# EAGLE design lightsensor (EAGLE 7.5.0)
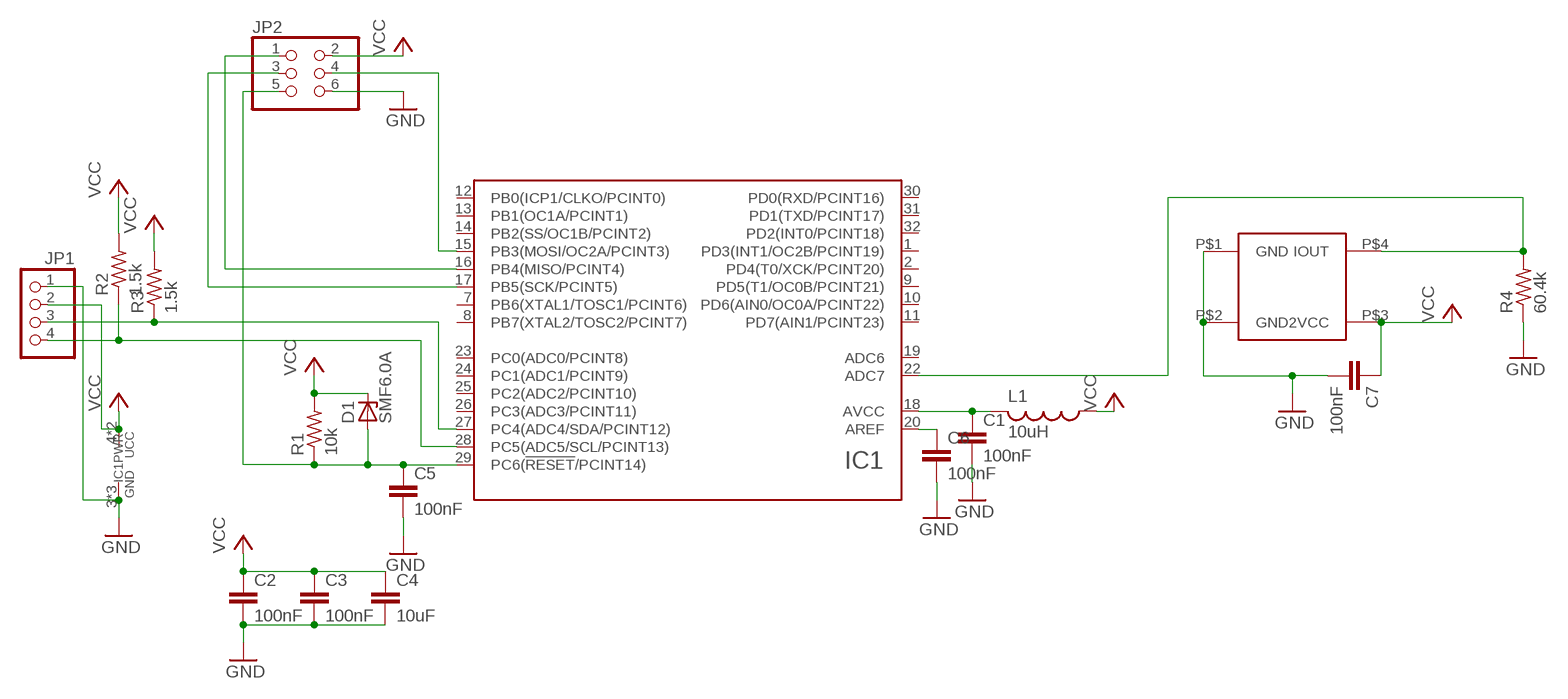
[diagram p0: schematic, sheet 1]

## Parts
C1  100nF  C-EUC0402  [C0402]
C2  100nF  C-EUC0402  [C0402]
C3  100nF  C-EUC0402  [C0402]
C4  10uF  C-EUC0603  [C0603]
C5  100nF  C-EUC0402  [C0402]
C6  100nF  C-EUC0402  [C0402]
C7  100nF  C-EUC0402  [C0402]
D1  SMF6.0A  [SOD123F]
IC1  ATMEGA48/88/168/328-AU  [TQFP32-08]
JP1  PINHD-1X4  [1X04]
JP2  PINHD-2X3  [2X03]
L1  10uH  L-USL2012C  [L2012C]
R1  10k  R-US_R0402  [R0402]
R2  1.5k  R-US_R0402  [R0402]
R3  1.5k  R-US_R0402  [R0402]
R4  60.4k  R-US_R0603  [R0603]
U$1  SFH5711  [SFH5711]

## Nets
GND: C1.2 C2.2 C3.2 C4.2 C5.2 C6.2 C7.2 IC1.3(GND) IC1.5(GND) IC1.21(GND) JP1.1 JP2.6 R4.1 U$1.P$1(GND) U$1.P$2(GND2)
N$1: C1.1 IC1.18(AVCC) L1.2
N$2: IC1.16(PB4(MISO/PCINT4)) JP2.1
N$3: IC1.17(PB5(SCK/PCINT5)) JP2.3
N$4: IC1.15(PB3(MOSI/OC2A/PCINT3)) JP2.4
N$5: C5.1 D1.A IC1.29(PC6(!RESET!/PCINT14)) JP2.5 R1.1
N$6: C6.1 IC1.20(AREF)
N$7: IC1.27(PC4(ADC4/SDA/PCINT12)) JP1.3 R3.1
N$8: IC1.22(ADC7) R4.2 U$1.P$4(IOUT)
N$9: IC1.28(PC5(ADC5/SCL/PCINT13)) JP1.4 R2.1
VCC: C2.1 C3.1 C4.1 C7.1 D1.C IC1.4(UCC) IC1.6(UCC) JP1.2 JP2.2 L1.1 R1.2 R2.2 R3.2 U$1.P$3(VCC)
Unconnected: IC1.1(PD3(INT1/OC2B/PCINT19)) IC1.2(PD4(T0/XCK/PCINT20)) IC1.7(PB6(XTAL1/TOSC1/PCINT6)) IC1.8(PB7(XTAL2/TOSC2/PCINT7)) IC1.9(PD5(T1/OC0B/PCINT21)) IC1.10(PD6(AIN0/OC0A/PCINT22)) IC1.11(PD7(AIN1/PCINT23)) IC1.12(PB0(ICP1/CLKO/PCINT0)) IC1.13(PB1(OC1A/PCINT1)) IC1.14(PB2(SS/OC1B/PCINT2)) IC1.19(ADC6) IC1.23(PC0(ADC0/PCINT8)) IC1.24(PC1(ADC1/PCINT9)) IC1.25(PC2(ADC2/PCINT10)) IC1.26(PC3(ADC3/PCINT11)) IC1.30(PD0(RXD/PCINT16)) IC1.31(PD1(TXD/PCINT17)) IC1.32(PD2(INT0/PCINT18))

## Library data of the parts
C1-C7 = resistor:C-EU: CAPACITOR, European symbol
D1 = smf_10:SMF*A: SMF Series TVS Diodes Source: http://www.littelfuse.com/~/media/electronics/datasheets/tvs_diodes/littelfuse_tvs_diode_smf_datasheet.pdf.pdf; MF: Littelfuse; MPN: SMF6.0A; OC_FARNELL: unknown; OC_NEWARK: unknown
IC1 = atmel_tiny24-44-84tiny48-88mega48-88-168-328:ATMEGA48/88/168/328
JP1 = pinhead:PINHD-1X4: PIN HEADER
JP2 = pinhead:PINHD-2X3: PIN HEADER
L1 = resistor:L-US: INDUCTOR, American symbol
R1-R4 = resistor:R-US_: RESISTOR, American symbol
U$1 = osram:SFH5711

## Board
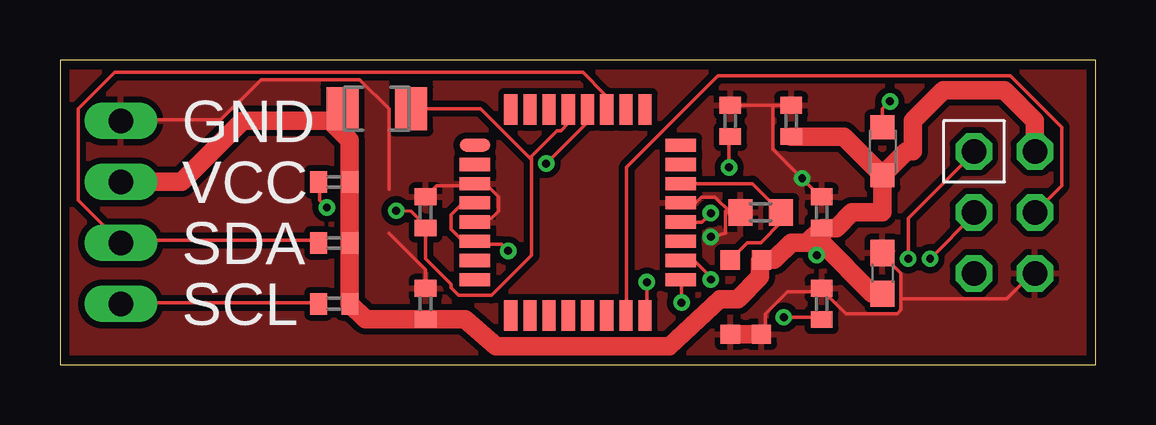
[diagram p1: board, top side]
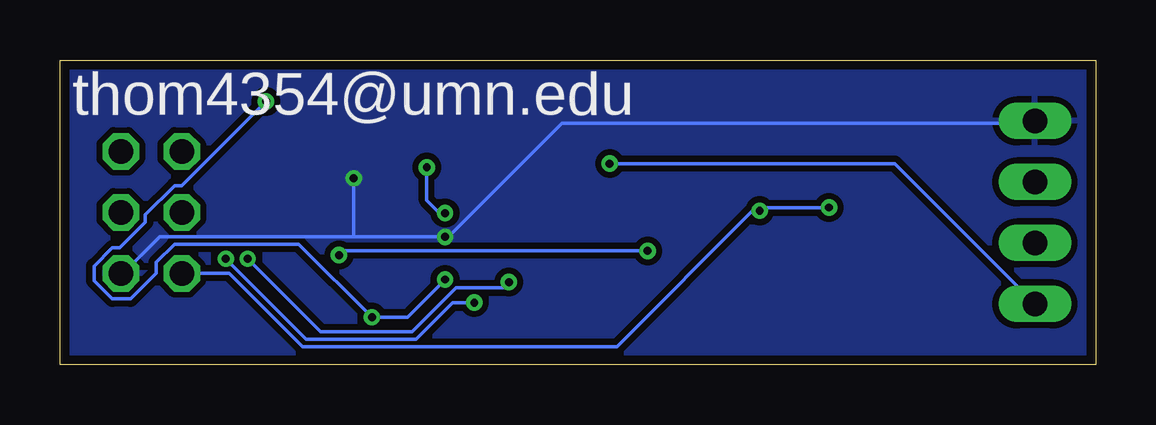
[diagram p2: board, bottom side, seen from below]

Size 43.18 x 12.7 mm. Coordinates in mm from the lower left corner, seen from the top.
Outline: 0,0 43.18,0 43.18,12.7 0,12.7 0,0
Copper layers (1*16): Top 0.0356mm / dielectric 1.5011mm / Bottom 0.0356mm
Design rules "oshpark-2layer": minimum track width 6mil, minimum drill 13mil, track to track 6mil, track to pad 6mil, pad to pad 6mil, via to via 6mil, smd to smd 6mil, copper to edge 15mil, drill to drill 6mil, minimum pad ring 7mil, minimum via ring 7mil, stop-mask expansion 2.5mil, vias tented up to drill 0mil, thermal gap 10mil

### Footprints (pad centres in the part's own frame; a part is rotated, then mirrored left to right if it is on the bottom)
C0402 = smd 0.7 x 0.9: 1 -0.65,0; 2 0.65,0
C0603 = smd 1.1 x 1: 1 -0.85,0; 2 0.85,0
SOD123F = smd 1.34 x 1.8: A 1.43,0; C -1.43,0
TQFP32-08 = smd 1.27 x 0.55: 1 -4.293,2.8; 2 -4.293,2; 3 -4.293,1.2; 4 -4.293,0.4; 5 -4.293,-0.4; 6 -4.293,-1.2; 7 -4.293,-2; 8 -4.293,-2.8; 17 4.293,-2.8; 18 4.293,-2; 19 4.293,-1.2; 20 4.293,-0.4; 21 4.293,0.4; 22 4.293,1.2; 23 4.293,2; 24 4.293,2.8 | smd 0.55 x 1.27: 9 -2.8,-4.293; 10 -2,-4.293; 11 -1.2,-4.293; 12 -0.4,-4.293; 13 0.4,-4.293; 14 1.2,-4.293; 15 2,-4.293; 16 2.8,-4.293; 25 2.8,4.293; 26 2,4.293; 27 1.2,4.293; 28 0.4,4.293; 29 -0.4,4.293; 30 -1.2,4.293; 31 -2,4.293; 32 -2.8,4.293
1X04 = drill 1.016 long: 1 -3.81,0; 2 -1.27,0; 3 1.27,0; 4 3.81,0
2X03 = drill 1.016 octagon: 1 -2.54,-1.27; 2 -2.54,1.27; 3 0,-1.27; 4 0,1.27; 5 2.54,-1.27; 6 2.54,1.27
L2012C = smd 1 x 1: 1 -1,0; 2 1,0
R0402 = smd 0.7 x 0.9: 1 -0.65,0; 2 0.65,0
R0603 = smd 1 x 1.1: 1 -0.85,0; 2 0.85,0
SFH5711 = smd 0.8 x 0.8: P$1 0,0; P$2 1.3,0; P$3 1.3,3.1; P$4 0,3.1

### Placement (x,y rotation side)
C1  31.75,2.54 90 top
C2  31.75,6.35 90 top
C3  15.24,2.54 90 top
C4  34.29,3.81 90 top
C5  15.24,6.35 90 top
C6  27.94,10.16 90 top
C7  30.48,10.16 90 top
D1  13.21,10.67 0 top
IC1  21.59,6.35 0 top
JP1  2.54,6.35 270 top
JP2  39.37,6.35 270 top
L1  34.29,8.89 90 top
R1  11.43,7.62 0 top
R2  11.43,2.54 0 top
R3  11.43,5.08 0 top
R4  29.21,6.35 0 top
U$1  27.94,1.27 0 top

### Tracks (layer width: path | path; a pad name or v marks a point on that pad's centre or on a via)
GND  (via drill 0.33)
  Top 0.152: IC1.5 17.37,6.1 17.98,6.1 18.29,6.4 18.29,7.01 17.83,7.47 17.37,7.47 IC1.3 17.22,7.47 15.7,7.47 C5.2 | C3.2 15.24,3.96 13.72,5.49 | 13.72,7.32 13.72,10.67 12.5,11.89 8.38,11.89 6.71,10.21 2.59,10.21 JP1.1 | 29.72,10.82 C7.2 | 29.72,10.82 28.04,10.82 C6.2 | 29.72,10.82 29.72,8.99 v30.94,7.77 31.7,7.01 C2.2 | U$1.P$2 29.41,1.52 29.41,2.13 30.33,3.05 31.7,3.05 C1.2 31.85,3.05 32.77,2.13 34.9,2.13 35.05,2.29 35.05,2.74 | 35.05,2.74 35.05,3.81 34.29,4.57 C4.2 | 27.74,6.4 28.35,6.4 R4.1 | 25.91,6.71 IC1.21 26.5,6.75 26.73,6.98 27.31,6.98 27.94,6.35 27.79,6.35 27.74,6.4 | 27.74,6.4 27.74,5.49 v27.13,5.33 | 35.05,2.74 39.47,2.74 40.54,3.81 JP2.6
  Top 0.762: U$1.P$1 U$1.P$2
  Bottom 0.152: 30.94,5.33 39.01,5.33 40.54,3.81 JP2.6 | 30.94,5.33 v27.13,5.33 26.98,5.33 22.25,10.06 2.59,10.06 JP1.1 | 30.94,5.33 v30.94,7.77
  pour Top (isolate 0.254): 0,12.7 43.18,12.7 43.18,0 0,0
  pour Bottom (isolate 0.254): 0,12.7 43.18,12.7 43.18,0 0,0
N$1  (via drill 0.33)
  Top 0.152: v30.18,1.98 31.7,1.98 C1.1 | IC1.18 25.91,4.27 26.52,4.27 27.13,3.66 v27.13,3.55 | L1.2 34.29,10.67 v34.59,10.97
  Bottom 0.152: v34.59,10.97 38.1,7.47 38.41,7.47 39.62,6.25 39.62,5.94 40.69,4.88 41,4.88 41.76,4.12 41.76,3.5 41,2.74 40.23,2.74 39.17,3.81 39.17,4.27 38.41,5.03 33.22,5.03 v30.18,1.98 28.7,1.98 v27.13,3.55
N$2  (via drill 0.33)
  Top 0.152: v35.36,4.42 35.36,6.1 38.1,8.84 JP2.1 | 24.54,2.13 IC1.16 24.47,2.13 v24.47,3.44
  Bottom 0.152: v35.36,4.42 32.31,1.37 28.5,1.37 26.67,3.2 24.71,3.2 v24.47,3.44
N$3  (via drill 0.33)
  Top 0.152: v25.91,2.59 25.91,3.5 IC1.17 | v36.27,4.42 38.1,6.25 JP2.3
  Bottom 0.152: v25.91,2.59 26.82,2.59 28.35,1.07 32.92,1.07 v36.27,4.42
N$4
  Top 0.152: JP2.4 41.76,7.47 41.76,9.91 39.62,12.04 27.43,12.04 23.62,8.23 23.62,2.13 IC1.15
N$5  (via drill 0.33)
  Top 0.152: 19.66,8.53 19.66,8.69 20.73,9.75 20.88,9.75 21.18,10.06 21.18,10.52 IC1.29 | 19.66,8.53 19.66,4.57 17.98,2.9 16.61,2.9 16.31,3.2 16.31,3.35 15.24,4.42 C5.1 15.24,5.79 14.63,6.4 v14.01,6.42 | v11.12,6.55 10.82,6.86 10.82,7.62 R1.1 | D1.A 17.53,10.67 19.66,8.53
  Bottom 0.152: v11.12,6.55 14.17,6.55 v14.01,6.42 14.31,6.42 19.96,0.76 33.07,0.76 36.12,3.81 JP2.5
N$6  (via drill 0.33)
  Top 0.152: v27.89,8.23 27.89,9.45 C6.1 | 25.91,6.1 IC1.20 26.75,5.95 v27.13,6.32
  Bottom 0.152: v27.89,8.23 27.89,6.86 27.35,6.32 v27.13,6.32
N$7
  Top 0.152: R3.1 10.67,5.18 2.59,5.18 JP1.3 0.76,6.86 0.76,10.67 2.29,12.19 21.79,12.19 22.71,11.28 22.71,10.67 IC1.27
N$8
  Top 0.152: IC1.22 28.86,7.55 R4.2 30.06,5.93 29.21,5.08 28.65,5.08 U$1.P$4
N$9  (via drill 0.33)
  Top 0.152: R2.1 10.67,2.59 2.59,2.59 JP1.4 | v20.27,8.38 21.95,10.06 21.95,10.52 IC1.28
  Bottom 0.152: v20.27,8.38 8.38,8.38 JP1.4
VCC  (via drill 0.33)
  Top 0.152: IC1.4 17.22,6.71 16.76,6.71 16.31,6.25 16.31,5.64 16.76,5.18 17.22,5.18 IC1.6 17.37,5.03 18.4,5.03 v18.68,4.75 | 34.44,3.35 34.29,3.35 | 34.29,3.35 34.14,3.35 | v31.55,4.57 31.55,4.88 31.75,5.08 | 34.29,3.35 C4.1
  Top 0.762: JP1.2 5.08,7.62 7.62,10.16 11.27,10.16 | 11.27,10.16 D1.C | 11.27,10.16 12.08,9.35 R1.2 R3.2 R2.2 12.73,1.89 C3.1 16.89,1.89 18.17,0.78 25.41,0.78 27.51,2.74 28.25,2.74 29.18,3.66 29.18,4.31 U$1.P$3 29.77,4.37 30.48,5.08 31.13,5.08 C2.1 | JP2.2 40.64,10.16 39.37,11.43 36.83,11.43 35.56,10.16 35.56,8.89 35.29,8.89 L1.1 | L1.1 34.29,6.35 33.02,6.35 32.37,5.7 C2.1 | C2.1 31.75,5.08 33.87,2.96 C4.1 | C7.1 32.67,9.51 L1.1
  Bottom 0.152: v18.68,4.75 31.37,4.75 v31.55,4.57

### Text on the board
tPlace: GND | VCC | SDA | SCL
bPlace: thom4354@umn.edu